# EAGLE design optical_encoder (EAGLE 8.6.0)
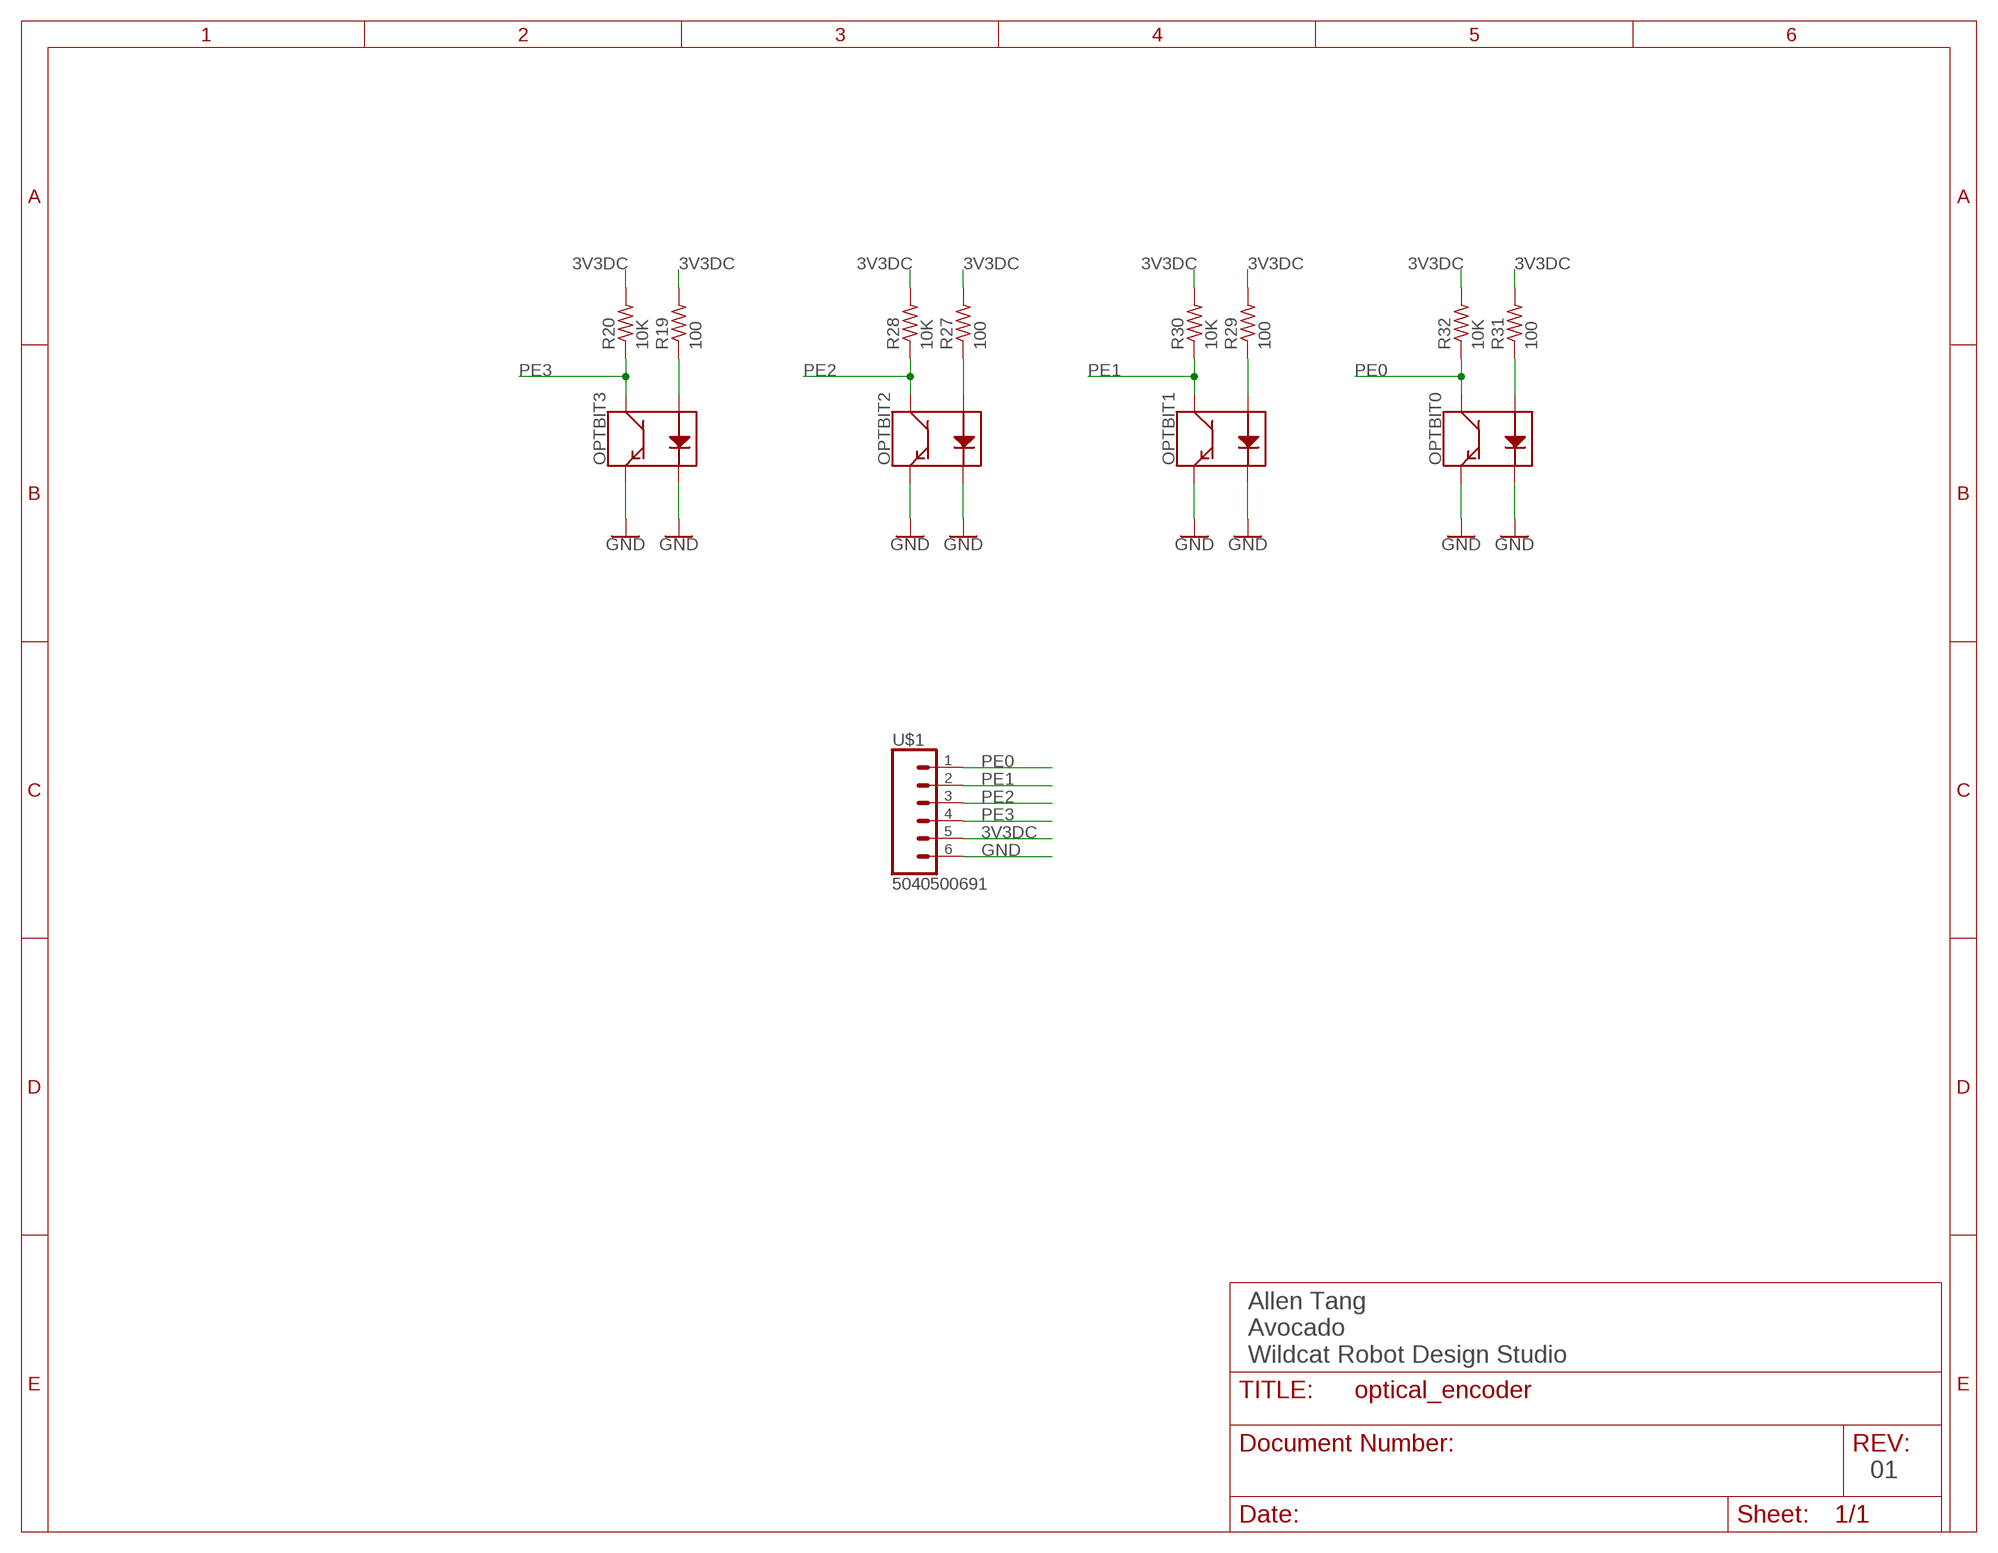
[diagram p0: schematic, sheet 1]

## Parts
OPTBIT0  QRE1113  [QRE1113]
OPTBIT1  QRE1113  [QRE1113]
OPTBIT2  QRE1113  [QRE1113]
OPTBIT3  QRE1113  [QRE1113]
R19  100  R-US_R0402  [R0402]
R20  10K  R-US_R0402  [R0402]
R27  100  R-US_R0402  [R0402]
R28  10K  R-US_R0402  [R0402]
R29  100  R-US_R0402  [R0402]
R30  10K  R-US_R0402  [R0402]
R31  100  R-US_R0402  [R0402]
R32  10K  R-US_R0402  [R0402]
U$1  5040500691  [5040500691]

## Nets
3V3DC: R19.2 R20.2 R27.2 R28.2 R29.2 R30.2 R31.2 R32.2 U$1.5
GND: OPTBIT0.2(K) OPTBIT0.4(E) OPTBIT1.2(K) OPTBIT1.4(E) OPTBIT2.2(K) OPTBIT2.4(E) OPTBIT3.2(K) OPTBIT3.4(E) U$1.6
N$4: OPTBIT3.1(A) R19.1
N$9: OPTBIT2.1(A) R27.1
N$12: OPTBIT1.1(A) R29.1
N$14: OPTBIT0.1(A) R31.1
PE0: OPTBIT0.3(C) R32.1 U$1.1
PE1: OPTBIT1.3(C) R30.1 U$1.2
PE2: OPTBIT2.3(C) R28.1 U$1.3
PE3: OPTBIT3.3(C) R20.1 U$1.4

## Notes on the sheet
- Allen Tang
  Avocado
  Wildcat Robot Design Studio
- 01

## Library data of the parts
OPTBIT0 OPTBIT1-OPTBIT3 = avocado:QRE1113: QRE1113 Reflective Object Sensor The QRE1113 is a small IR reflectance sensor. This sensor is often used in line following robots because, if it can sense if a surface is white or black. There are four pins on the QRE1113 - two control the IR emitting LED while the other two are the collector and emitter of a phototransistor. The IR diode has a max forward current of 50mA and operates at 940nm. Datasheet <http://www.sparkfun.com/datasheets/Components/SMD/QRE1113.GR.pdf> SparkFun Products IR Reflectance Sensor - QRE1113 <https://www.sparkfun.com/products/9542> (COM-09542) SparkFun Line Sensor Breakout - QRE1113 (Analog) <https://www.sparkfun.com/products/9453> (ROB-09453) SparkFun Line Sensor Breakout - QRE1113 (Digital) <https://www.sparkfun.com/products/9454> (ROB-09454) SparkFun RedBot Sensor - Line Follower <https://www.sparkfun.com/products/11769> (SEN-11769) SparkFun RedBot Sensor - Wheel Encoder <https://www.sparkfun.com/products/12617> (SEN-12617) SparkFun Line Follower Array <https://www.sparkfun.com/products/13582> (SEN-13582); PROD_ID: IC-09357; SF_ID: COM-09542
R19 R20 R27-R32 = rcl:R-US_: RESISTOR, American symbol; SPICEPREFIX: R
U$1 = avocado:5040500691: Molex Pico-Lock, 6POS, Surface Mount

## Board
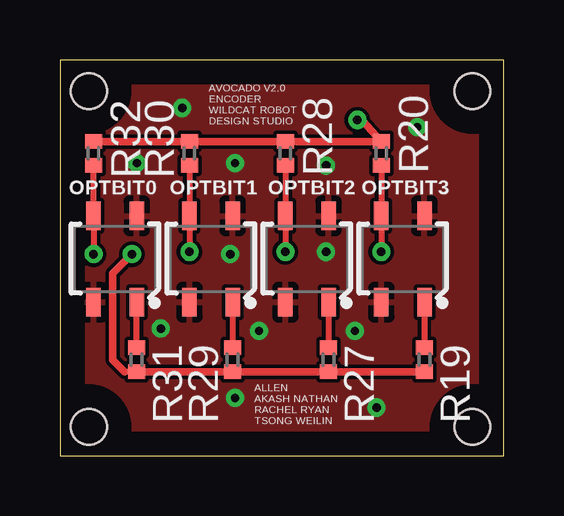
[diagram p1: board, top side]
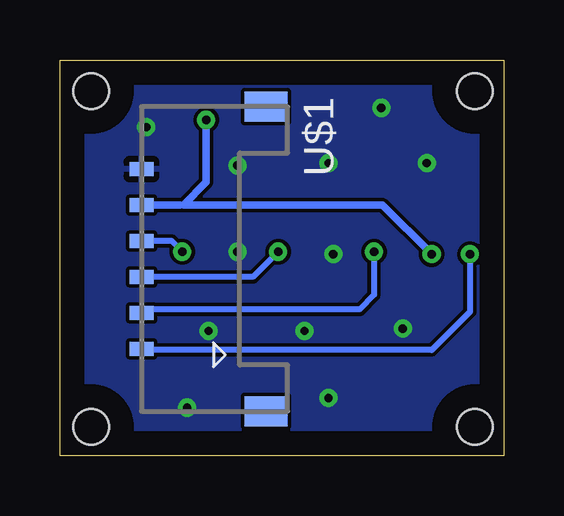
[diagram p2: board, bottom side, seen from below]

Size 18.5 x 16.5 mm. Coordinates in mm from the lower left corner, seen from the top.
Outline: 0,0 18.5,0 18.5,16.5 0,16.5 0,0
Copper layers (1*16): Top 0.035mm / dielectric 1.5mm / Bottom 0.035mm
Design rules "default": minimum track width 6mil, minimum drill 0.35mm, track to track 6mil, track to pad 6mil, pad to pad 6mil, via to via 6mil, smd to smd 6mil, copper to edge 40mil, drill to drill 6mil, minimum pad ring 10mil, minimum via ring 8mil, stop-mask expansion 4mil, vias tented up to drill 0mil, thermal gap 10mil
Holes 1.5 mm at 1.2,1.2 17.2,15.2 17.2,1.2 1.2,15.2

### Footprints (pad centres in the part's own frame; a part is rotated, then mirrored left to right if it is on the bottom)
QRE1113 = smd 1.2 x 0.6: 1 -1.8,-0.9; 2 1.8,-0.9; 3 1.8,0.9; 4 -1.8,0.9
R0402 = smd 0.6 x 0.7: 1 -0.5,0; 2 0.5,0
5040500691 = smd 0.6 x 1: 1 3.75,0; 2 2.25,0; 3 0.75,0; 4 -0.75,0; 5 -2.25,0; 6 -3.75,0 | smd 1.25 x 1.8: P$7 6.355,5.19; P$8 -6.355,5.19

### Placement (x,y rotation side)
OPTBIT0  2.3,8.2 90 top
OPTBIT1  6.3,8.2 90 top
OPTBIT2  10.3,8.2 90 top
OPTBIT3  14.3,8.2 90 top
R19  15.2,4 270 top
R20  13.4,12.6 90 top
R27  11.2,4 270 top
R28  9.4,12.6 90 top
R29  7.2,4 270 top
R30  5.4,12.6 90 top
R31  3.2,4 270 top
R32  1.4,12.6 90 top
U$1  15.1,8.2 270 bottom

### Tracks (layer width: path | path; a pad name or v marks a point on that pad's centre or on a via)
3V3DC  (via drill 0.35)
  Top 0.254: 12.6,14 v12.4,14 | R31.2 2.7,3.5
  Top 0.305: R32.2 R30.2 R28.2 R20.2 12.6,14 | R31.2 R29.2 R27.2 R19.2 | 2.7,3.5 2.2,4 2.2,7.6 v3,8.4
  Bottom 0.254: 13.35,10.45 13.5,10.45
  Bottom 0.305: v12.4,14 12.4,11.4 13.35,10.45 5.05,10.45 v3,8.4 | 13.5,10.45 U$1.5
GND  (via drill 0.35)
  other vias: 3.2,12.2 5.1,14.5 7.3,12.2 14.9,13.7 7.1,8.4 11.1,8.5 11.1,12.1 4.2,5.3 8.3,5.2 12.3,5.2 13.2,2 7.3,2.4
  pour Bottom: -2.7,21.2 22.8,21.2 22.8,-4.8 -2.7,-4.8
  pour Top: -2.7,21.3 22.8,21.2 22.8,-4.8 -2.7,-4.7
N$4
  Top 0.254: OPTBIT3.1 R19.1
N$9
  Top 0.254: OPTBIT2.1 R27.1
N$12
  Top 0.254: OPTBIT1.1 R29.1
N$14
  Top 0.254: R31.1 OPTBIT0.1
PE0  (via drill 0.35)
  Top 0.254: R32.1 OPTBIT0.3 v1.4,8.4
  Bottom 0.254: v1.4,8.4 1.4,6 3,4.4 15.05,4.4 U$1.1
PE1  (via drill 0.35)
  Top 0.254: v5.4,8.5 OPTBIT1.3 R30.1
  Bottom 0.254: v5.4,8.5 5.4,6.7 6,6.1 14.95,6.1 U$1.2
PE2  (via drill 0.35)
  Top 0.254: v9.4,8.5 OPTBIT2.3 R28.1
  Bottom 0.254: v9.4,8.5 10.45,7.45 U$1.3
PE3  (via drill 0.35)
  Top 0.254: v13.4,8.5 OPTBIT3.3 R20.1
  Bottom 0.254: v13.4,8.5 13.85,8.95 U$1.4

### Text on the board
tPlace: AVOCADO V2.0 / ENCODER / WILDCAT ROBOT / DESIGN STUDIO | ALLEN / AKASH NATHAN / RACHEL RYAN / TSONG WEILIN